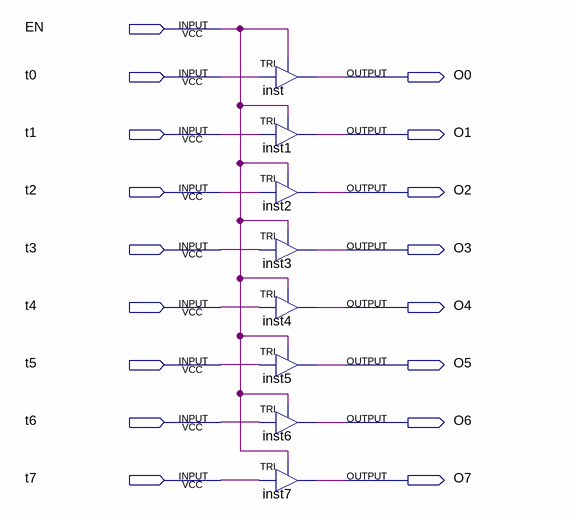
[diagram p0: schematic sheet]
// Quartus schematic tri-8.bdf as structural Verilog: 8 symbols, 17 pins
module \tri-8  (
  input  EN,
  input  t0,
  input  t1,
  input  t2,
  input  t3,
  input  t4,
  input  t5,
  input  t6,
  input  t7,
  output O0,
  output O1,
  output O2,
  output O3,
  output O4,
  output O5,
  output O6,
  output O7
);

  TRI inst (.IN(t0), .OE(EN), .OUT(O0));
  TRI inst1 (.IN(t1), .OE(EN), .OUT(O1));
  TRI inst2 (.IN(t2), .OE(EN), .OUT(O2));
  TRI inst3 (.IN(t3), .OE(EN), .OUT(O3));
  TRI inst4 (.IN(t4), .OE(EN), .OUT(O4));
  TRI inst5 (.IN(t5), .OE(EN), .OUT(O5));
  TRI inst6 (.IN(t6), .OE(EN), .OUT(O6));
  TRI inst7 (.IN(t7), .OE(EN), .OUT(O7));
endmodule
